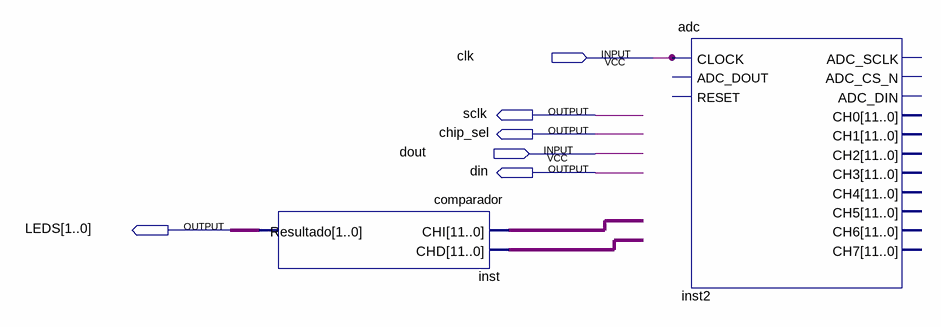
[diagram p0: schematic sheet]
// Quartus schematic comp_prueba.bdf as structural Verilog: 2 symbols, 6 pins
module comp_prueba (
  input  clk,
  input  dout,
  output sclk,
  output chip_sel,
  output din,
  output [1:0] LEDS
);

  wire [11:0] undriven, undriven_2;

  comparador inst (.CHI(undriven), .CHD(undriven_2), .Resultado(LEDS));
  adc inst2 (.CLOCK(clk));  // open: ADC_DOUT, RESET, ADC_SCLK, ADC_CS_N, ADC_DIN, CH0, CH1, CH2, CH3, CH4, CH5, CH6, CH7
endmodule
